# EAGLE design ATC1 (EAGLE 7.4.0)
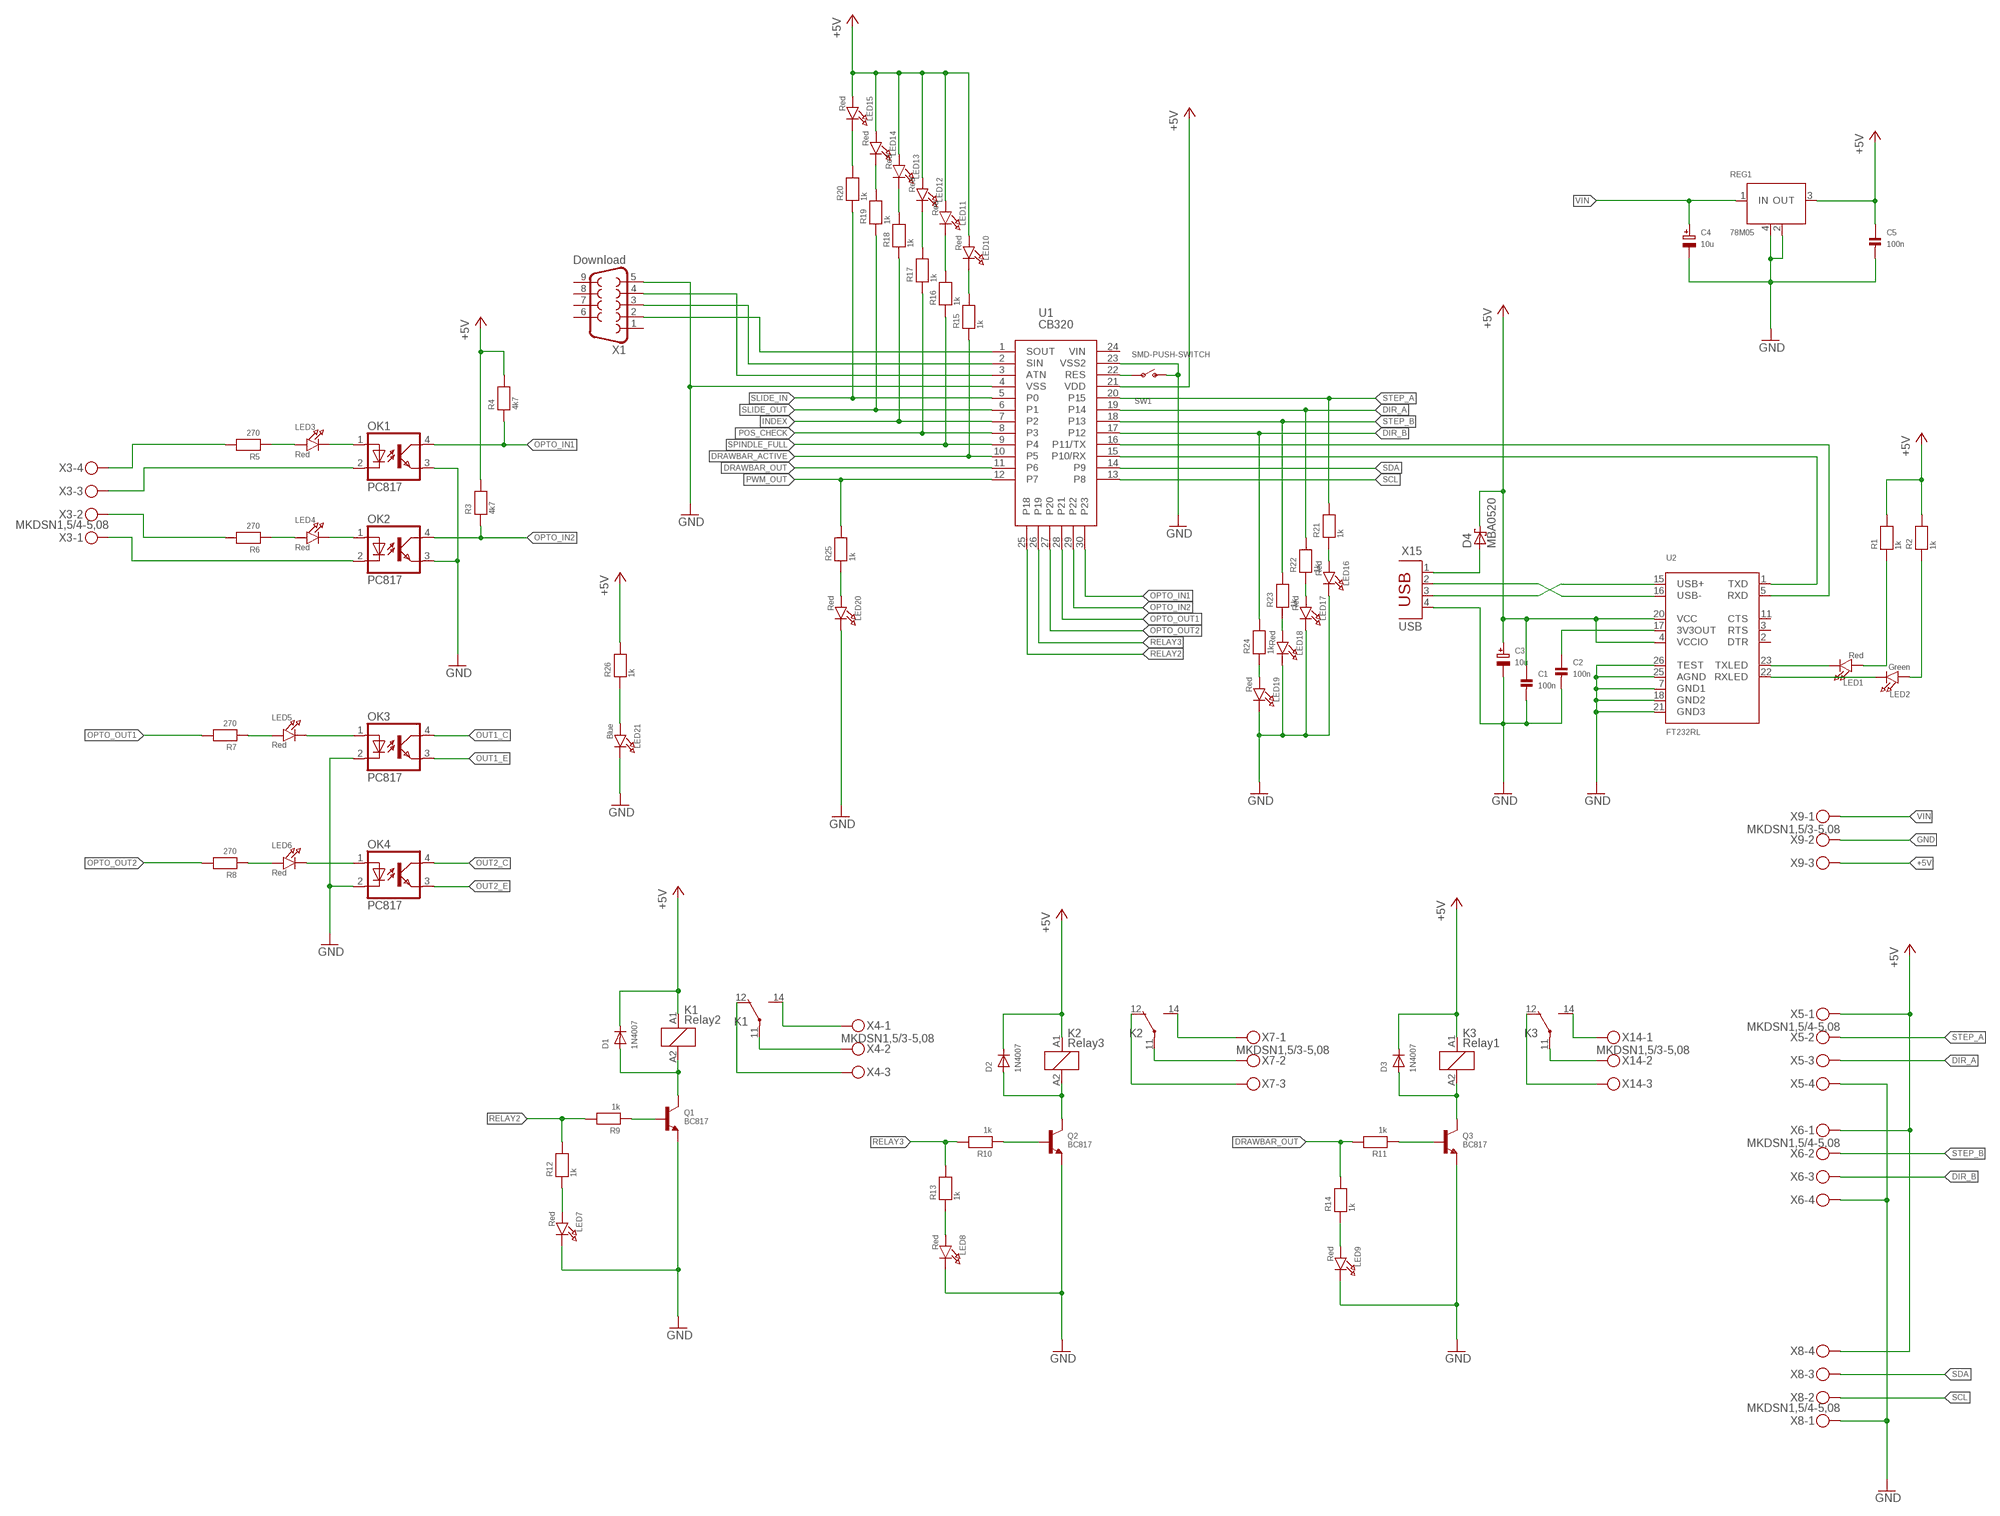
[diagram p0: schematic, sheet 1, part 1 of 2]
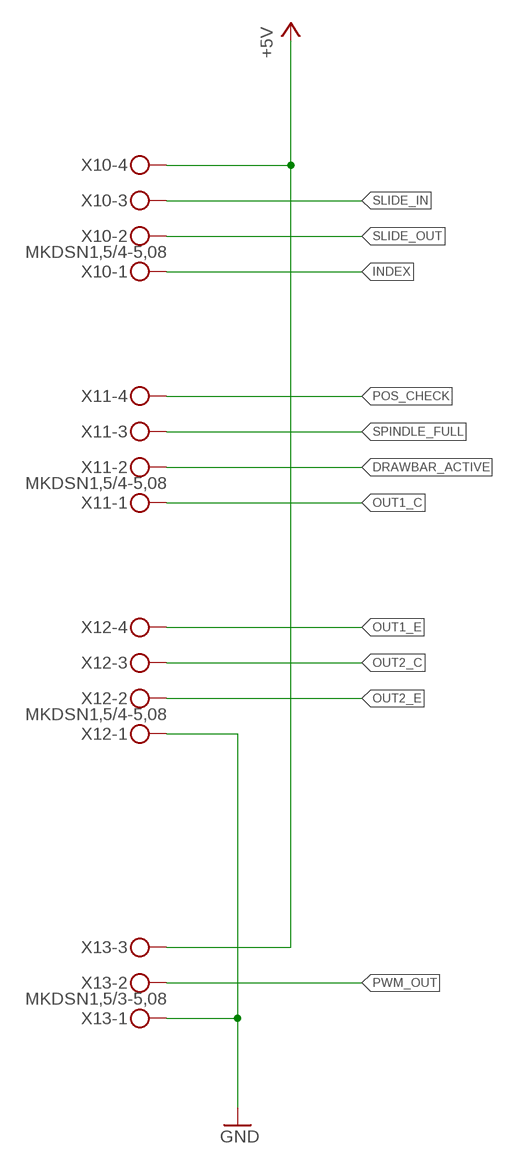
[diagram p1: schematic, sheet 1, part 2 of 2]

## Parts
C1  100n  CAP_CERAMIC0805  [0805]
C2  100n  CAP_CERAMIC0805  [0805]
C3  10u  CAP_TANTALUMA/3216_REFLOW  [EIA3216-18/A-R]
C4  10u  CAP_TANTALUMA/3216_REFLOW  [EIA3216-18/A-R]
C5  100n  CAP_CERAMIC0805  [0805]
D1  1N4007  DIODESOD-123  [SOD-123]
D2  1N4007  DIODESOD-123  [SOD-123]
D3  1N4007  DIODESOD-123  [SOD-123]
D4  MBA0520  MBR0520  [SOD123]
K1  Relay2  SRD-05VDC-SL-C  [SRD]
K2  Relay3  SRD-05VDC-SL-C  [SRD]
K3  Relay1  SRD-05VDC-SL-C  [SRD]
LED1  Red  LED0805  [CHIPLED_0805]
LED2  Green  LED0805  [CHIPLED_0805]
LED3  Red  LED0805  [CHIPLED_0805]
LED4  Red  LED0805  [CHIPLED_0805]
LED5  Red  LED0805  [CHIPLED_0805]
LED6  Red  LED0805  [CHIPLED_0805]
LED7  Red  LED0805  [CHIPLED_0805]
LED8  Red  LED0805  [CHIPLED_0805]
LED9  Red  LED0805  [CHIPLED_0805]
LED10  Red  LED0805  [CHIPLED_0805]
LED11  Red  LED0805  [CHIPLED_0805]
LED12  Red  LED0805  [CHIPLED_0805]
LED13  Red  LED0805  [CHIPLED_0805]
LED14  Red  LED0805  [CHIPLED_0805]
LED15  Red  LED0805  [CHIPLED_0805]
LED16  Red  LED0805  [CHIPLED_0805]
LED17  Red  LED0805  [CHIPLED_0805]
LED18  Red  LED0805  [CHIPLED_0805]
LED19  Red  LED0805  [CHIPLED_0805]
LED20  Red  LED0805  [CHIPLED_0805]
LED21  Blue  LED0805  [CHIPLED_0805]
OK1  PC817  [SM4-GW]
OK2  PC817  [SM4-GW]
OK3  PC817  [SM4-GW]
OK4  PC817  [SM4-GW]
Q1  BC817  TRANSISTOR_NPNWIDE  [SOT23-WIDE]
Q2  BC817  TRANSISTOR_NPNWIDE  [SOT23-WIDE]
Q3  BC817  TRANSISTOR_NPNWIDE  [SOT23-WIDE]
R1  1k  RESISTOR0805  [0805]
R2  1k  RESISTOR0805  [0805]
R3  4k7  RESISTOR0805  [0805]
R4  4k7  RESISTOR0805  [0805]
R5  270  RESISTOR0805  [0805]
R6  270  RESISTOR0805  [0805]
R7  270  RESISTOR0805  [0805]
R8  270  RESISTOR0805  [0805]
R9  1k  RESISTOR0805  [0805]
R10  1k  RESISTOR0805  [0805]
R11  1k  RESISTOR0805  [0805]
R12  1k  RESISTOR0805  [0805]
R13  1k  RESISTOR0805  [0805]
R14  1k  RESISTOR0805  [0805]
R15  1k  RESISTOR0805  [0805]
R16  1k  RESISTOR0805  [0805]
R17  1k  RESISTOR0805  [0805]
R18  1k  RESISTOR0805  [0805]
R19  1k  RESISTOR0805  [0805]
R20  1k  RESISTOR0805  [0805]
R21  1k  RESISTOR0805  [0805]
R22  1k  RESISTOR0805  [0805]
R23  1k  RESISTOR0805  [0805]
R24  1k  RESISTOR0805  [0805]
R25  1k  RESISTOR0805  [0805]
R26  1k  RESISTOR0805  [0805]
REG1  78M05  UA78M05  [UA78M05]
SW1  SMD-PUSH-SWITCH  [PUSH-BUTTON-SMD]
U1  CB320  CUBLOC-CB320  [DIL24]
U2  FT232RL  FT232RLSSOP28  [SSOP28DB]
X1  Download  F09HP  [F09HP]
X3  MKDSN1,5/4-5,08  [MKDSN1,5/4-5,08]
X4  MKDSN1,5/3-5,08  [MKDSN1,5/3-5,08]
X5  MKDSN1,5/4-5,08  [MKDSN1,5/4-5,08]
X6  MKDSN1,5/4-5,08  [MKDSN1,5/4-5,08]
X7  MKDSN1,5/3-5,08  [MKDSN1,5/3-5,08]
X8  MKDSN1,5/4-5,08  [MKDSN1,5/4-5,08]
X9  MKDSN1,5/3-5,08  [MKDSN1,5/3-5,08]
X10  MKDSN1,5/4-5,08  [MKDSN1,5/4-5,08]
X11  MKDSN1,5/4-5,08  [MKDSN1,5/4-5,08]
X12  MKDSN1,5/4-5,08  [MKDSN1,5/4-5,08]
X13  MKDSN1,5/3-5,08  [MKDSN1,5/3-5,08]
X14  MKDSN1,5/3-5,08  [MKDSN1,5/3-5,08]
X15  USB  PN61729  [PN61729]

## Nets
+5V: C1.1 C3.+ C5.1 D1.C D2.C D3.C D4.C K1.A1 K2.A1 K3.A1 LED10.A LED11.A LED12.A LED13.A LED14.A LED15.A R1.2 R2.2 R3.2 R4.2 R26.2 REG1.3(OUT) U1.21(VDD) U2.4(VCCIO) U2.20(VCC) X5.1 X6.1 X8.4 X9.3 X10.4 X13.3
DIR_A: R22.2 U1.19(P14) X5.3
DIR_B: R24.2 U1.17(P12) X6.3
DRAWBAR_ACTIVE: R15.1 U1.10(P5) X11.2
DRAWBAR_OUT: R11.2 R14.2 U1.11(P6)
GND: C1.2 C2.2 C3.- C4.- C5.2 LED7.C LED8.C LED9.C LED16.C LED17.C LED18.C LED19.C LED20.C LED21.C OK1.3(EMIT) OK2.3(EMIT) OK3.2(C) OK4.2(C) Q1.2(E) Q2.2(E) Q3.2(E) REG1.2(COMMON1) REG1.4(COMMON2) SW1.P$2(S) U1.4(VSS) U1.23(VSS2) U2.7(GND1) U2.18(GND2) U2.21(GND3) U2.25(AGND) U2.26(TEST) X1.5 X5.4 X6.4 X8.1 X9.2 X12.1 X13.1 X15.4
INDEX: R18.1 U1.7(P2) X10.1
N$1: U2.15(USB+) X15.3
N$2: U2.16(USB-) X15.2
N$3: U1.2(SIN) X1.3
N$4: C2.1 U2.17(3V3OUT)
N$5: LED3.C OK1.1(A)
N$6: U1.1(SOUT) X1.2
N$7: LED2.C U2.22(RXLED)
N$8: LED1.C U2.23(TXLED)
N$9: LED1.A R1.1
N$10: LED2.A R2.1
N$11: LED3.A R5.1
N$12: U1.15(P10/RX) U2.1(TXD)
N$13: U1.16(P11/TX) U2.5(RXD)
N$14: U1.3(ATN) X1.4
N$15: R5.2 X3.4
N$16: LED4.C OK2.1(A)
N$17: LED4.A R6.1
N$18: R6.2 X3.2
N$19: OK1.2(C) X3.3
N$20: OK2.2(C) X3.1
N$21: LED5.A R7.1
N$22: LED5.C OK3.1(A)
N$23: LED6.A R8.1
N$24: LED6.C OK4.1(A)
N$25: Q1.1(B) R9.1
N$26: Q2.1(B) R10.1
N$27: D2.A K2.A2 Q2.3(C)
N$28: D1.A K1.A2 Q1.3(C)
N$29: Q3.1(B) R11.1
N$30: D3.A K3.A2 Q3.3(C)
N$31: K3.14(O) X14.1
N$32: K3.11(P) X14.2
N$33: K1.14(O) X4.1
N$34: K1.11(P) X4.2
N$35: K1.12(C) X4.3
N$36: K2.11(P) X7.2
N$37: K2.12(C) X7.3
N$38: K2.14(O) X7.1
N$39: K3.12(C) X14.3
N$40: D4.A X15.1
N$42: SW1.P$1(P) U1.22(RES)
N$46: LED9.A R14.1
N$47: LED8.A R13.1
N$48: LED7.A R12.1
N$49: LED10.C R15.2
N$50: LED11.C R16.2
N$51: LED12.C R17.2
N$52: LED13.C R18.2
N$53: LED14.C R19.2
N$54: LED15.C R20.2
N$56: LED19.A R24.1
N$57: LED20.A R25.1
N$58: LED17.A R22.1
N$59: LED18.A R23.1
N$60: LED16.A R21.1
N$62: LED21.A R26.1
OPTO_IN1: OK1.4(COL) R4.1 U1.30(P23)
OPTO_IN2: OK2.4(COL) R3.1 U1.29(P22)
OPTO_OUT1: R7.2 U1.28(P21)
OPTO_OUT2: R8.2 U1.27(P20)
OUT1_C: OK3.4(COL) X11.1
OUT1_E: OK3.3(EMIT) X12.4
OUT2_C: OK4.4(COL) X12.3
OUT2_E: OK4.3(EMIT) X12.2
POS_CHECK: R17.1 U1.8(P3) X11.4
PWM_OUT: R25.2 U1.12(P7) X13.2
RELAY2: R9.2 R12.2 U1.25(P18)
RELAY3: R10.2 R13.2 U1.26(P19)
SCL: U1.13(P8) X8.2
SDA: U1.14(P9) X8.3
SLIDE_IN: R20.1 U1.5(P0) X10.3
SLIDE_OUT: R19.1 U1.6(P1) X10.2
SPINDLE_FULL: R16.1 U1.9(P4) X11.3
STEP_A: R21.2 U1.20(P15) X5.2
STEP_B: R23.2 U1.18(P13) X6.2
VIN: C4.+ REG1.1(IN) X9.1
Unconnected: U1.24(VIN) U2.2(DTR) U2.3(RTS) U2.11(CTS) X1.1 X1.6 X1.7 X1.8 X1.9

## Library data of the parts
C1 C2 C5 = microbuilder:CAP_CERAMIC: Ceramic Capacitors 0402 - 0402 Surface Mount Capacitors 16pF 50V 5% [Digikey: 445-4899-2-ND] 18pF 50V 5% [Digikey: 490-1281-2-ND] 22pF 50V 5% [Digikey: 490-1283-2-ND] 68pF 50V 5% [Digikey: 490-1289-2-ND] 0.1uF 10V 10% [Digikey: 490-1318-2-ND] 1.0uF 6.3V 10% [Digikey: 490-1320-2-ND] 0603 - 0603 Surface Mount Capacitors 16 pF 50V 5% [Digikey: 445-5051-2-ND] 22 pF 50V [Digikey: PCC220ACVTR-ND] 33 pF 50V 5% [Digikey: 490-1415-1-ND] 56pF 50V 5% [Digikey: 490-1421-1-ND] 220pF 50V 5% [Digikey: 445-1285-1-ND] 680 pF 50V 2200 pF 50V 5% C0G [Digikey: 445-1297-1-ND] 5600 pF 100V 5% X7R [Digikey: 478-3711-1-ND] 0.1 µF 25V 10% [Digikey: PCC2277TR-ND] 0.22 µF 16V 10% X7R [Digikey: 445-1318-1-ND] 1.0 µF 25V 10% [Digikey: 445-5146-2-ND] 0603 - RF Specific 3pF 250V +/-0.1pF RF [Digikey: 712-1347-1-ND] 18 pF 250V 5% [Digikey: 478-3505-1-ND or 712-1322-1-ND] 56 pF 250V 5% C0G RF [Digikey: 490-4867-1-ND] 68 pF 250V RF [Digikey: 490-4868-1-ND] 0805 - 0805 Surface Mount Capacitors 220 pF 250V 2% RF Ceramic Capacitor [Digikey: 712-1398-1-ND] 1000 pF 50V 2% NP0 Ceramic Capacitor [Digikey: 478-3760-1-ND] 0.1 µF 25V 10% Ceramic Capacitor [Digikey: PCC1828TR-ND] 1.0 µF 16V 10% Ceramic Capacitor[Digikey: 490-1691-2-ND] 10.0 µF 10V 10% Ceramic Capacitor[Digikey: 709-1228-1-ND] 10.0 uF 16V 10% Ceramic Capacitor [Digikey: 478-5165-2-ND] 47 uF 6.3V 20% Ceramic Capacitor [Digikey: 587-1779-1-ND or 399-5506-1-ND] 1206 - 1206 Surface Mount Capacitors 47uF 10V 20% Ceramic Capacitor [Digikey: 490-5528-1-ND or 399-5508-1-ND or 445-6010-1-ND] 100uF 6.3V -20%, +80% Y5V Ceramic Capacitor (Digikey: 490-4512-1-ND, Mouser: 81-GRM31CF50J107ZE1L)
C3 C4 = microbuilder:CAP_TANTALUM: Tantalum Capacitors Wave footprints have larger pads and are meant to be used for hand soldering. Reflow footprints are optimised for solder paste and a reflow oven. EIA3216-18/A-[R/W] - Size A / 3216-18 / 1206 footprint 4.7µF 25V 10% Tantalum Capacitor 10µF 16V 10% Tantalum Capacitor [Digikey: 495-2236-2-ND] EIA3528-21/B-[R/W] - Size B / 3528-21 47µF 10V 10% Tantalum Capactior [Digikey: 495-2216-1-ND] EIA6032-28/C-[R/W] - Size C / 6032-28 10µF 35V 20% Tantalum Capacitor [Digikey: 495-2285-1-ND] 100µF 16V 10% Tantalum Capactior [Digikey: 399-5214-1-ND]
D1-D3 = adafruit:DIODE: Diode SMADIODE - SMA Surface Mount Package 20V 1A Schottky Diode Digikey: 641-1014-6-ND DO-1N4148 - Through Hole Small Current Diode SOD-123 20V 1 A (.5mV Vf) Schottky Diode - Digikey: MBRX120TPMSCT-ND SOD-323 10V 570mA (.38mV Vf, 3ns) Schottky Diode - Digikey: ZLLS410CT-ND SOD-523 30V 30mA Schottky Diode (RB751S-40TE61) - Digikey: RB751S-40TE61CT-ND SOT23-R/W - SOT23 Package (R = Solder Paste/Reflow Ovens, W = Hand-Soldering) BAT54Film 40V 300mA - Digikey: 497-7162-1-ND
D4 = Peters:MBR0520
K1-K3 = Peters:SRD-05VDC-SL-C
LED1-LED21 = microbuilder:LED: LED 0603 - 0603 Surface Mount Package 2mA: Green LED - Low Power (3.9mcd, 2ma, 1.7Vf) - Digikey: 475-2709-2-ND Orange LED - Low Power (9.8mcd, 2ma, 1.8Vf) - Digikey: 475-1194-2-ND Red LED - Low Power (5mcd, 2ma, 1.8Vf) - Digikey: 475-1195-2-ND Yellow LED - Low Power (7mcd, 2ma, 1.8Vf) - Digikey: 475-1196-2-ND 5mA: Blue LED - Low Power (17mcd, 5ma, 2.9Vf) - Digikey: LNJ937W8CRACT-ND 0805 - 0805 Surface Mount Package 2mA: Red LED (8.8mcd, 2mA, 1.8Vf, Clear) - Low Power [Digikey: 475-2510-1-ND] Green LED (5mcd, 2mA, 1.8Vf, Clear) - Low Power [Digikey: 475-2730-1-ND] Yellow LED (11.3mcd, 2mA, 1.8Vf, Clear) - Low Power [Digikey: 475-2555-1-ND] 20mA: Red LED (104mcd, 20mA, Diffused) - LS R976 [Digikey: 475-1278-6-ND] Red LED (12mcd, 20mA, 2.0Vf, Clear) - APT2012EC [Digikey: 754-1128-1-ND] Green LED (15mcd, 20mA, 2.2Vf, Clear) - APT2012GC [Digikey: 754-1131-1-ND] Orange LED (160mcd, 20mA, 2.1Vf, Clear) - APT2012SECK [Digikey: 754-1130-1-ND] 1206 - 1206 Surface Mount Package Green LED (26mcd, 20mA, Diffused) - LG N971 [Digikey: 475-1407-6-ND] Red LED (15mcd, 20mA, Diffused) - LH N974 [Digikey: 475-1416-6-ND]
OK1-OK4 = Peters:PC817
Q1-Q3 = microbuilder:TRANSISTOR_NPN: NPN Transistor Transistor (NPN) 500mA 45V - BC817 [Digikey: 568-1631-1-ND] Transistor (NPN) 500mA 45V - BC817,215 [Mouser: 771-BC817-T/R] SOT23-R - SOT23 footprint optimised for use with solder paste and reflow ovens. SOT23-W - SOT23 footprint optimised for hand-soldering (larger pads).
R1-R26 = microbuilder:RESISTOR: Resistors 0402 - 0402 Surface Mount Package 22 Ohm 1% 1/16W [Digikey: 311-22.0LRTR-ND] 33 Ohm 5% 1/16W 1.0K 5% 1/16W 1.5K 5% 1/16W 2.0K 1% 1/16W 10.0K 1% 1/16W [Digikey: 311-10.0KLRTR-ND] 10.0K 5% 1/16W [Digikey: RMCF0402JT10K0TR-ND] 12.1K 1% 1/16W [Digikey: 311-22.0LRTR-ND] 100.0K 5% 1/16W 0603 - 0603 Surface Mount Package 0 Ohm 1/10 Watt 1% Resistor 15 Ohm 1/10 Watt 1% Resistor 33 Ohm 1/10 Watt 1% Resistor 49.9 Ohm 1/10 Watt 1% Resistor 100 Ohm 1/10 Watt 1% Resistor 150 Ohm 1/10 Watt 1% Resistor 240 Ohm 1/10 Watt 1% Resistor 390 Ohm 1/10 Watt 1% Resistor 560 Ohm 1/10 Watt 1% Resistor 680 Ohm 1/10 Watt 1% Resistor 750 Ohm 1/10 Watt 1% Resistor 1.0K Ohm 1/10 Watt 1% Resistor 1.5K Ohm 1/10 Watt 1% Resistor 2.0K Ohm 1/10 Watt 1% Resistor 2.2K Ohm 1/10 Watt 1% Resistor 3.3K Ohm 1/10 Watt 1% Resistor 4.7K Ohm 1/10 Watt 1% Resistor 10.0K Ohm 1/10 Watt 1% Resistor 12.0K Ohm 1/10 Watt 1% Resistor 12.1K Ohm 1/10 Watt 1% Resistor 20.0K Ohm 1/10 Watt 1% Resistor 33.0K Ohm 1/10 Watt 1% Resistor 100.0K Ohm 1/10 Watt 1% Resistor 0805 - 0805 Surface Mount Package 0 Ohm 1/8 Watt 1% Resistor 33 Ohm 1/8 Watt 1% Resistor 100 Ohm 1/8 Watt 1% Resistor 150 Ohm 1/8 Watt 1% Resistor 200 Ohm 1/8 Watt 1% Resistor 240 Ohm 1/8 Watt 1% Resistor 330 Ohm 1/8 Watt 1% Resistor 390 Ohm 1/8 Watt 1% Resistor 470 Ohm 1/8 Watt 1% Resistor 1.0K Ohm 1/8 Watt 1% Resistor 1.5K Ohm 1/8 Watt 1% Resistor 2.0K Ohm 1/8 Watt 1% Resistor 4.7K Ohm 1/8 Watt 1% Resistor 5.1K Ohm 1/8 Watt 1% Resistor 5.6K Ohm 1/8 Watt 1% Resistor 10.0K Ohm 1/8 Watt 1% Resistor 22.0K Ohm 1/8 Watt 1% Resistor 33.0K Ohm 1/8 Watt 1% Resistor 100K Ohm 1/8 Watt 1% Resistor 1206 - 1206 Surface Mount Package 2012 - 2010 Surface Mount Package 0.11 Ohm 1/2 Watt 1% Resistor - Digikey: RHM.11UCT-ND
REG1 = Peters:UA78M05
SW1 = Peters:SMD-PUSH-SWITCH
U1 = Peters:CUBLOC-CB320: Cubloc CB-320 PLC
U2 = microbuilder:FT232RL: FTDI FT232RL USB TO RS232 Converter Digikey: 768-1007-1-ND
X1 = con-subd:F09: SUB-D; OC_FARNELL: unknown; OC_NEWARK: unknown
X3 X5 X6 X8 X10-X12 = con-phoenix-508:MKDSN1,5/4-5,08: MKDSN 1,5/ 4-5,08 Printklemme Nennstrom: 13,5 A Nennspannung: 250 V Rastermaß: 5,08 mm Polzahl: 4 Anschlussart: Schraubanschluss Montage: Löten Anschlussrichtung Leiter/Platine: 0 ° Artikelnummer: 1729144 Source: http://eshop.phoenixcontact.com .. 1729144.pdf
X4 X7 X9 X13 X14 = con-phoenix-508:MKDSN1,5/3-5,08: MKDSN 1,5/ 3-5,08 Printklemme Nennstrom: 13,5 A Nennspannung: 250 V Rastermaß: 5,08 mm Polzahl: 3 Anschlussart: Schraubanschluss Montage: Löten Anschlussrichtung Leiter/Platine: 0 ° Artikelnummer: 1729131 Source: http://eshop.phoenixcontact.com .. 1729131.pdf
X15 = con-berg:PN61729: BERG USB connector; OC_FARNELL: unknown; OC_NEWARK: unknown

## Board
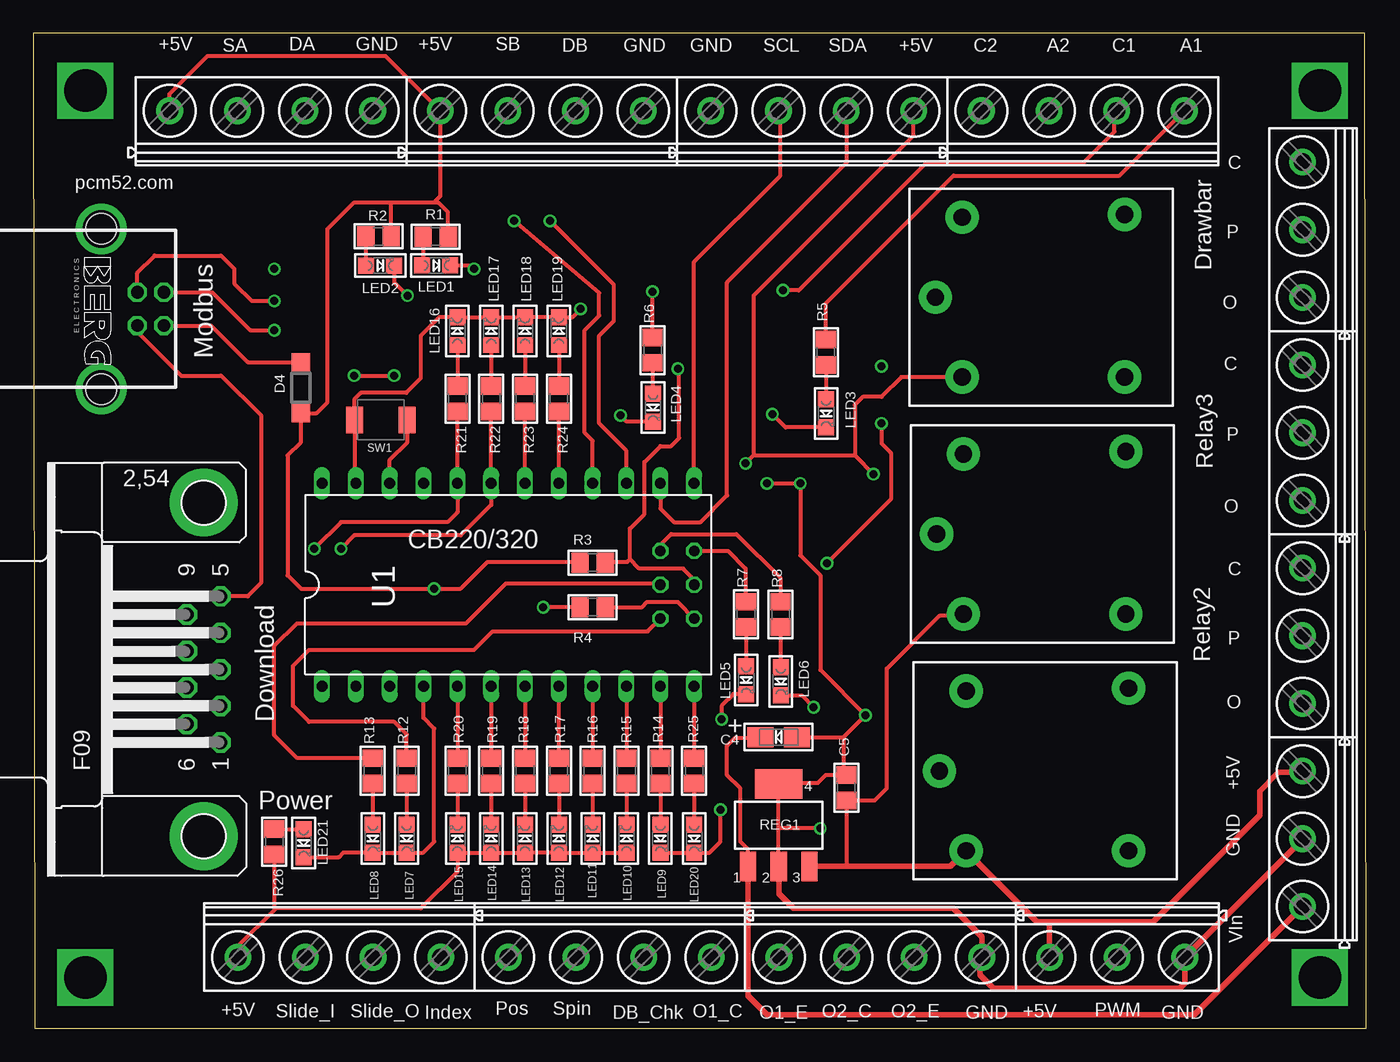
[diagram p2: board, top side]
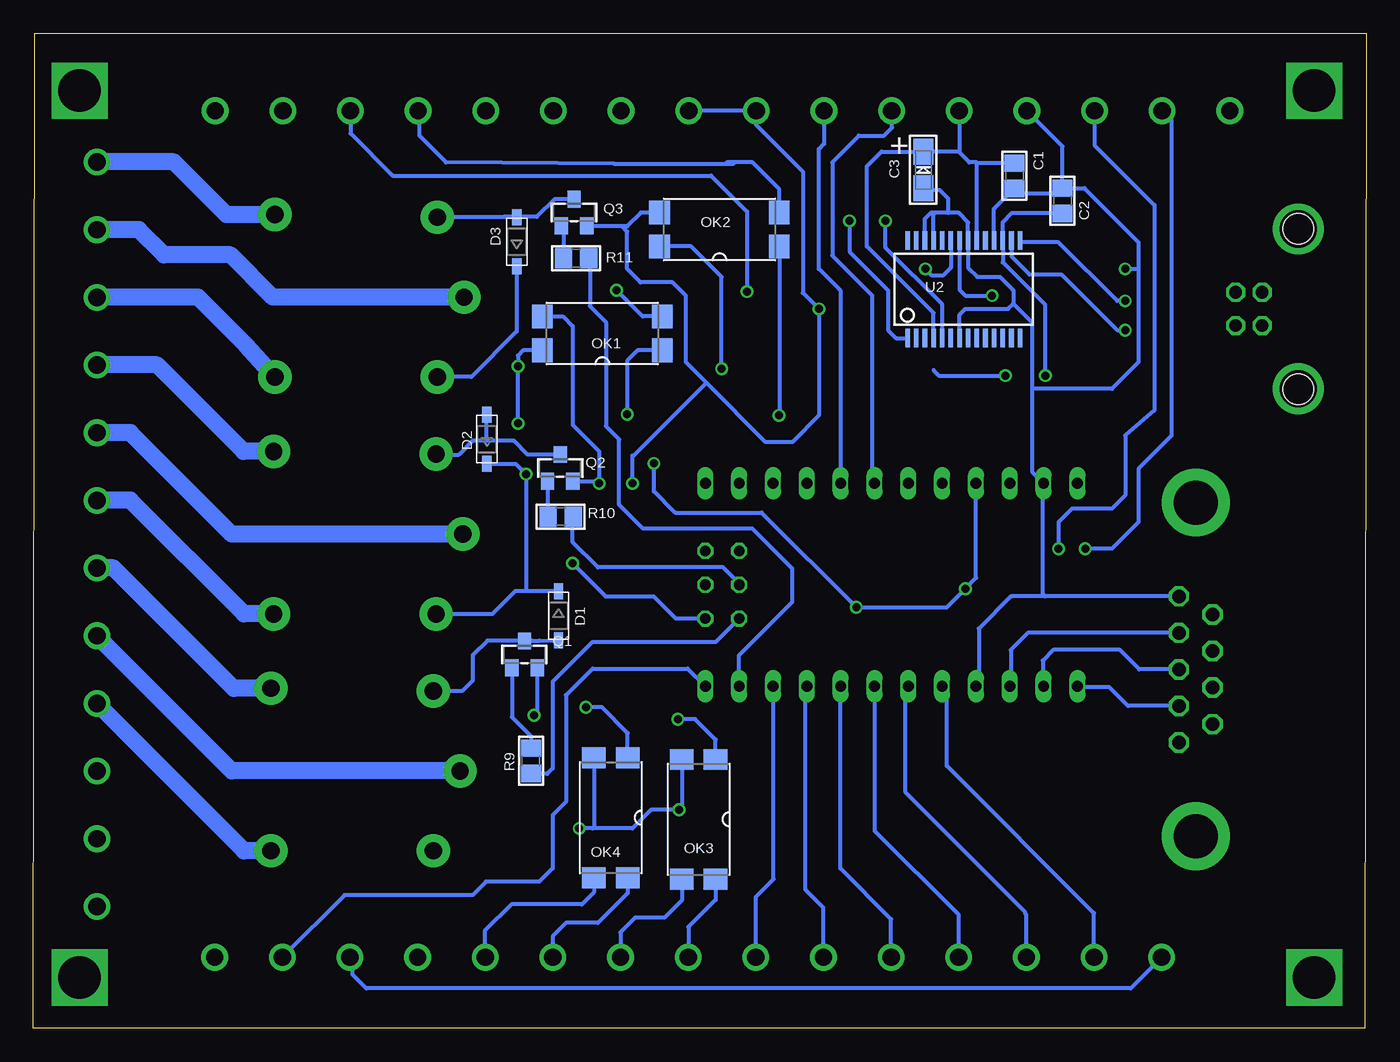
[diagram p3: board, bottom side, seen from below]

Size 100.1 x 74.69 mm. Coordinates in mm from the lower left corner, seen from the top.
Outline: 0.1,0 100.1,0 100,74.69 0,74.69 0.1,0
Copper layers (1*16): Top 0.0356mm / dielectric 1.5011mm / Bottom 0.0356mm
Design rules "LaenPCBOrder": minimum track width 6mil, minimum drill 13mil, track to track 6mil, track to pad 6mil, pad to pad 6mil, via to via 6mil, smd to smd 6mil, copper to edge 15mil, drill to drill 6mil, minimum pad ring 7mil, minimum via ring 7mil, stop-mask expansion 3mil, vias tented up to drill 0mil, thermal gap 10mil

### Footprints (pad centres in the part's own frame; a part is rotated, then mirrored left to right if it is on the bottom)
0805 = smd 1.3 x 1.5: 1 -0.95,0; 2 0.95,0
EIA3216-18/A-R = smd 1.95 x 1.5: + 1.375,0; - -1.375,0
SOD-123 = smd 1.2 x 0.7: A 1.85,0; C -1.85,0
SOD123 = smd 1.4 x 1.4: A 1.265,0; C -2.535,0
SRD = drill 1.3 pad 2.5: 11 7.62,0; 12 -6.58,-6.2; 14 -6.58,6; A1 5.62,6; A2 5.62,-6
CHIPLED_0805 = smd 1.2 x 1.2: A 0,-1.05; C 0,1.05
SM4-GW = smd 1.55 x 1.78: 1 9.31,0; 2 9.31,2.54; 3 0.31,2.54; 4 0.31,0
SOT23-WIDE = smd 1 x 1.27: 1 -0.95,-1; 2 0.95,-1; 3 0,1
UA78M05 = smd 1.219 x 2.235: 1 -2.311,-3.099; 2 0,-3.099; 3 2.311,-3.099 | smd 3.6 x 2.2: 4 0,3.099
PUSH-BUTTON-SMD = smd 1.27 x 2: P$1 -2.22,0; P$2 1.72,0
DIL24 = drill 0.813 long: 1 -7.62,12.7; 2 -7.62,10.16; 3 -7.62,7.62; 4 -7.62,5.08; 5 -7.62,2.54; 6 -7.62,0; 7 -7.62,-2.54; 8 -7.62,-5.08; 9 -7.62,-7.62; 10 -7.62,-10.16; 11 -7.62,-12.7; 12 -7.62,-15.24; 13 7.62,-15.24; 14 7.62,-12.7; 15 7.62,-10.16; 16 7.62,-7.62; 17 7.62,-5.08; 18 7.62,-2.54; 19 7.62,0; 20 7.62,2.54; 21 7.62,5.08; 22 7.62,7.62; 23 7.62,10.16; 24 7.62,12.7 | drill 0.8 octagon: 25 -2.54,-12.7; 26 0,-12.7; 27 2.54,-12.7; 28 2.54,-15.24; 29 0,-15.24; 30 -2.54,-15.24
SSOP28DB = smd 0.348 x 1.397: 1 -4.225,-3.656; 2 -3.575,-3.656; 3 -2.925,-3.656; 4 -2.275,-3.656; 5 -1.625,-3.656; 6 -0.975,-3.656; 7 -0.325,-3.656; 8 0.325,-3.656; 9 0.975,-3.656; 10 1.625,-3.656; 11 2.275,-3.656; 12 2.925,-3.656; 13 3.575,-3.656; 14 4.225,-3.656; 15 4.225,3.656; 16 3.575,3.656; 17 2.925,3.656; 18 2.275,3.656; 19 1.625,3.656; 20 0.975,3.656; 21 0.325,3.656; 22 -0.325,3.656; 23 -0.975,3.656; 24 -1.625,3.656; 25 -2.275,3.656; 26 -2.925,3.656; 27 -3.575,3.656; 28 -4.225,3.656
F09HP = drill 1.016 octagon: 1 -5.486,-1.27; 2 -2.743,-1.27; 3 0,-1.27; 4 2.743,-1.27; 5 5.486,-1.27; 6 -4.115,1.27; 7 -1.372,1.27; 8 1.372,1.27; 9 4.115,1.27 | drill 3.302 pad 5.08: G1 -12.522,0; G2 12.522,0
MKDSN1,5/4-5,08 = drill 1.3 pad 2: 1 -7.641,0.025; 2 -2.561,0.025; 3 2.519,0.025; 4 7.599,0.025
MKDSN1,5/3-5,08 = drill 1.3 pad 2: 1 -7.641,0.025; 2 -2.561,0.025; 3 2.519,0.025
PN61729 = drill 0.95 octagon: 1 1.25,4.71; 2 -1.25,4.71; 3 -1.25,2.71; 4 1.25,2.71 | hole 2.3: -6.02,0; 6.02,0

### Placement (x,y rotation side)
C1  26.41,63.99 270 bottom
C2  22.81,62.11 90 bottom
C3  33.26,64.43 90 bottom
C4  55.98,21.86 180 top
C5  61.06,18.05 90 top
D1  60.66,30.96 270 bottom
D2  66.04,44.22 90 bottom
D3  63.79,59.04 90 bottom
D4  20.1,48.72 90 top
K1  75.67,19.32 180 top
K2  75.47,37.1 180 top
K3  75.37,54.88 180 top
LED1  30.26,57.26 270 top
LED2  26.06,57.25 270 top
LED3  59.54,46.15 180 top
LED4  46.54,46.59 180 top
LED5  53.54,26.13 180 top
LED6  56.14,26.04 180 top
LED7  28.04,14.24 180 top
LED8  25.5,14.24 180 top
LED9  47.09,14.24 180 top
LED10  44.55,14.24 0 top
LED11  42.01,14.24 0 top
LED12  39.47,14.24 0 top
LED13  36.93,14.24 0 top
LED14  34.39,14.24 0 top
LED15  31.85,14.24 0 top
LED16  31.85,52.34 0 top
LED17  34.39,52.34 0 top
LED18  36.93,52.34 0 top
LED19  39.47,52.34 0 top
LED20  49.63,14.24 180 top
LED21  20.3,13.9 180 top
OK1  62.18,50.89 0 bottom
OK2  53.38,58.69 0 bottom
OK3  48.86,10.87 90 bottom
OK4  55.46,10.99 90 bottom
Q1  63.21,28.07 0 bottom
Q2  60.53,42.07 0 bottom
Q3  59.49,61.23 0 bottom
R1  30.22,59.43 0 top
R2  25.92,59.44 0 top
R3  42.01,34.96 180 top
R4  42.01,31.62 180 top
R5  59.52,50.75 90 top
R6  46.52,50.91 90 top
R7  53.52,31.07 90 top
R8  56.12,31.06 90 top
R9  62.73,20.07 270 bottom
R10  60.49,38.4 0 bottom
R11  59.33,57.8 0 bottom
R12  28.04,19.32 90 top
R13  25.5,19.32 90 top
R14  47.09,19.32 90 top
R15  44.55,19.32 270 top
R16  42.01,19.32 270 top
R17  39.47,19.32 270 top
R18  36.93,19.32 270 top
R19  34.39,19.32 270 top
R20  31.85,19.32 270 top
R21  31.85,47.26 270 top
R22  34.39,47.26 270 top
R23  36.93,47.26 270 top
R24  39.47,47.26 270 top
R25  49.63,19.32 90 top
R26  18.1,14 270 top
REG1  55.98,15.24 0 top
SW1  25.84,45.67 180 top
U1  34.39,33.29 90 top
U2  30.22,55.48 0 bottom
X1  12.8,26.94 90 top
X3  78.84,68.85 0 top
X4  95.35,32.02 90 top
X5  17.88,68.85 0 top
X6  38.2,68.85 0 top
X7  95.35,47.26 90 top
X8  58.52,68.85 0 top
X9  95.35,16.78 90 top
X10  22.96,5.35 180 top
X11  43.28,5.35 180 top
X12  63.6,5.35 180 top
X13  78.84,5.35 180 top
X14  95.35,62.5 90 top
X15  5.1,54 270 top

### Tracks (layer width: path | path; a pad name or v marks a point on that pad's centre or on a via)
+5V  (via drill 0.6)
  Top 0.305: LED10.A LED11.A LED12.A LED13.A LED14.A LED15.A 31.85,11.75 29.1,9 18.2,9 18.15,8.95 | X9.3 95.32,19.23 | 54.1,43 54.1,55 66.1,67 66.1,68.86 X8.4 | X10.4 15.36,6.16 18.15,8.95 | R4.2 38.32,31.62 v38.3,31.6 | 54.1,43 v53.5,42.4 | X5.1 10.24,70.14 13.1,73 26.43,73 X6.1 30.56,62.46 30.1,62 | R3.2 41.02,35 34.1,35 32.1,33 v30.1,33 20.1,33 19.1,34 19.1,43 20.1,44 D4.C 21.29,46.19 22.1,47 22.1,60 24.1,62 26.9,62 | 54.1,43 61.7,43 | 61.7,43 v63.1,41.6 | K2.A1 69.75,31 68.1,31 64.1,27 64.1,18 63.2,17.1 C5.1 61.06,12.18 61.1,12.14 | K3.A1 65.18,48.88 63.7,47.4 62.3,47.4 61.7,46.8 61.7,43 | 26.9,62 30.1,62 | 30.1,62 30.4,62 31.1,61.3 31.1,59.5 R1.2 | R2.2 26.87,61.97 26.9,62 | R26.2 18.1,9 18.15,8.95
  Top 0.406: 76.1,8 84.1,8 92.1,16 92.1,17.8 93.5,19.2 95.23,19.2 X9.3 | 76.1,8 75.37,8 K1.A1 68.87,12.14 61.1,12.14 REG1.3 | X13.3 76.32,7.78 76.1,8
  Bottom 0.305: X13.3 76.1,5.1 76.1,4 75.1,3 17.69,3 X10.4 | U1.21 29.3,33.8 v30.1,33 31.5,31.6 v38.3,31.6 45.4,38.7 51.9,38.7 53.5,40.3 v53.5,42.4 | 30.6,65.8 C3.+ 36.4,65.8 37.5,64.7 37.5,58.7 32.5,53.7 U2.4 | X6.1 30.56,65.84 30.6,65.8 | 29.25,65 29.8,65 30.6,65.8 | U2.20 29.25,65 | C1.1 29.19,64.94 29.25,65 | D3.C 63.79,52.31 67.2,48.9 69.73,48.9 K3.A1 | D1.C 63.1,32.81 | 63.1,32.81 63.91,32.81 65.62,31.1 K2.A1 | D2.C 63.87,42.37 v63.1,41.6 63.1,32.81
DIR_A  (via drill 0.6)
  Top 0.305: R22.2 U1.19 34.39,39.29 32.1,37 24.1,37 v23.1,36
  Bottom 0.305: X5.3 20.4,66.3 15.9,61.8 15.9,46.4 18.1,44.5 18.1,40 19.1,39 22.1,39 23.1,38 v23.1,36
DIR_B
  Top 0.305: U1.17 R24.2
  Bottom 0.305: U1.17 39.5,40.94 39.5,55.4 41.1,57 41.1,66 40.72,66.38 X6.3
DRAWBAR_ACTIVE
  Top 0.305: U1.10 R15.1
  Bottom 0.305: X11.2 45.84,9.86 44.5,11.2 44.5,25.62 U1.10
DRAWBAR_OUT
  Top 0.305: U1.11 R14.2
  Bottom 0.305: U1.11 47.09,28.01 43.1,32 43.1,34.5 46.1,37.5 54.3,37.5 56.1,39.3 56.1,44.2 57.1,45.2 57.1,53 58.3,54.2 58.3,57.72 R11.2 58.4,57.78
GND  (via drill 0.6)
  Top 0.305: LED9.C LED20.C 50.79,13.19 51.6,14 v51.6,16.4 | REG1.2 55.98,15 | 55.98,15 REG1.4 | 56,17.36 REG1.4 | 60.96,18.9 C5.2 | X9.2 95.32,14.17 | 60.86,21.86 v62.5,23.5 59.1,26.9 59.1,34 57.6,35.5 v57.6,40.9 v55.1,40.9 | U1.4 29.3,23.3 30.1,22.5 30.1,14 29.29,13.19 LED7.C LED8.C 23.3,13.2 22.95,12.85 LED21.C | 24.1,41.04 U1.23 24.12,41.02 SW1.P$2 24.1,45.69 24.1,47.2 24.6,47.7 28,47.7 29.1,48.8 29.1,52 30.49,53.39 LED16.C LED17.C LED18.C LED19.C 40.49,53.39 v41.1,54 | v59.1,15 55.98,15 | 17.99,57.11 v18.1,57 | X15.4 7.81,52.29 11.1,49 14.1,49 17.1,46 17.1,33.43 16.1,32.43 X1.5 | C5.2 59.5,19 58.9,18.4 56.04,18.4 REG1.4 | 60.86,21.86 60.86,19.2 C5.2 | C4.- 60.86,21.86
  Top 0.406: 95.32,14.17 X13.1 86.48,3.38 86.1,3 72.1,3 71.1,4 71.1,5.18 X12.1 71.24,6.86 69.1,9 57.1,9 56,10.1 56,12.12 REG1.2
  Bottom 0.305: X1.5 24.1,32.43 | 24.1,32.43 26.67,32.43 29.1,30 29.1,25.88 U1.4 | U2.18 27.95,61.51 C1.2 | C1.2 26.4,62.7 23.17,62.7 C2.2 | 26.39,63.06 C1.2 | C2.2 21.16,63.06 17.1,59 17.1,57 | 58.47,60.3 Q3.2 58.51,60.2 55.9,60.2 | 51.44,16.56 v51.6,16.4 | v51.6,16.4 53.7,16.4 55.1,15 58.1,15 | 58.1,15 v59.1,15 | v55.1,40.9 55.1,43 55,43 49.55,48.45 | 59.6,41.09 Q2.2 57.77,41.07 v57.6,40.9 57.6,43.3 59.6,45.3 59.6,52.7 60.33,53.43 OK1.3 | 50.9,68.85 X8.1 X6.4 45.8,67.8 42.3,64.3 42.3,55.2 v41.1,54 41.1,46 43.1,44 45.1,44 49.55,48.45 | 26.5,54.4 26.5,55.4 27.5,56.4 29.2,56.4 29.9,57.09 U2.21 29.9,60.49 30.6,61.2 31.4,61.2 | U2.7 30.55,53.55 30.1,54 26.9,54 26.5,54.4 | 26.5,54.4 25.1,53 25.1,48 | 25.1,48 25.1,41.78 U1.23 24.3,40.84 24.3,32.63 24.1,32.43 | C2.2 22.81,66.21 X5.4 | 17.1,57 17.1,50 19.1,48 25.1,48 | v18.1,57 17.1,57 | 33.2,63 C3.- 33.15,62.94 32.04,62.94 31.4,62.3 31.4,61.2 | Q1.2 62.26,23.74 v62.5,23.5 | OK2.3 54.47,61.23 55.5,60.2 55.9,60.2 | 49.55,48.45 51.1,50 51.1,55 52.1,56 54.5,56 55.5,57 55.5,59.8 55.9,60.2 | OK3.2 51.4,16.6 v51.6,16.4 | OK4.2 58,15.1 58.1,15 | 31.4,61.2 32.6,61.2 | 32.6,61.2 32.7,61.2 33.15,60.76 U2.26 | U2.25 32.5,61.09 32.6,61.2
INDEX
  Top 0.305: U1.7 R18.1
  Bottom 0.305: X10.1 30.6,8.5 36.9,14.8 36.9,25.64 U1.7
N$1  (via drill 0.6)
  Top 0.305: v18.09,54.61 v18.1,54.6 16.4,54.6 15.1,55.9 15.1,57 14.1,58 9.1,58 7.81,56.71 X15.3
  Bottom 0.305: v18.1,54.6 18.7,54.6 23.1,59 25.86,59 U2.15
N$2  (via drill 0.6)
  Top 0.305: 17.89,52.61 v18.1,52.4 16.3,52.4 13.45,55.25 X15.2
  Bottom 0.305: U2.16 26.65,57.95 25.3,56.6 22.9,56.6 18.7,52.4 v18.1,52.4
N$3
  Bottom 0.305: X1.3 17.04,26.94 18.5,28.4 23.5,28.4 24.3,27.6 24.3,25.74 U1.2
N$4  (via drill 0.6)
  Top 0.305: v24.1,49 v27.1,49
  Bottom 0.305: C2.1 22.85,61.2 26.6,61.2 27.3,60.51 U2.17 27.3,57.49 24.1,54.3 v24.1,49 | 32.5,49.4 32.1,49 v27.1,49
N$5  (via drill 0.6)
  Top 0.305: LED3.C 56.5,45.1 v55.5,46.1
  Bottom 0.305: OK1.1 54.71,50.89 55.5,50.1 v55.5,46.1
N$6
  Bottom 0.305: X1.2 17.9,24.2 19.3,25.6 21.62,25.6 U1.1
N$7  (via drill 0.6)
  Top 0.305: LED2.C 27.11,55.99 v28.1,55
  Bottom 0.305: U2.22 30.55,55.45 30.1,55 v28.1,55
N$8  (via drill 0.6)
  Top 0.305: LED1.C 32.84,57.26 v33.1,57
  Bottom 0.305: U2.23 31.2,57.1 31.8,56.5 32.6,56.5 v33.1,57
N$9
  Top 0.305: R1.1 29.27,57.32 LED1.A
N$10
  Top 0.305: R2.1 24.97,57.29 LED2.A
N$11
  Top 0.305: R5.1 59.52,47.22 LED3.A
N$12  (via drill 0.6)
  Top 0.305: U1.15 44.55,43.35 42.5,45.4 42.5,52 43.6,53.1 43.6,55.8 v38.8,60.6
  Bottom 0.305: v38.8,60.6 38.8,58.3 35.9,55.4 35.9,52.4 35.3,51.8 34.47,51.8 U2.1
N$13  (via drill 0.6)
  Top 0.305: U1.16 42.01,44.09 41.4,44.7 41.4,52.4 42.5,53.5 42.5,55.2 v36.1,60.6
  Bottom 0.305: U2.5 31.85,54.34 36.1,58.6 v36.1,60.6
N$14
  Bottom 0.305: X1.4 25.42,29.68 26.7,28.4 26.7,25.74 U1.3
N$15
  Top 0.305: X3.4 81.56,64 69.1,64 59.52,54.42 R5.2
N$16  (via drill 0.6)
  Top 0.305: LED4.C 44.56,45.54 v44.1,46
  Bottom 0.305: OK2.1 44.07,46.03 v44.1,46
N$17
  Top 0.305: LED4.A 46.54,49.94 R6.1
N$18  (via drill 0.6)
  Top 0.305: R6.2 46.52,55.28 v46.5,55.3
  Bottom 0.305: X3.2 76.28,67.18 73.1,64 49.2,64 46.5,61.3 v46.5,55.3
N$19  (via drill 0.6)
  Top 0.305: X3.3 81.2,68.72 81.2,67.3 78.9,65 67.1,65 57.5,55.4 v56.3,55.4
  Bottom 0.305: OK1.2 54.33,53.43 v56.3,55.4
N$20
  Bottom 0.305: X3.1 71.1,68.78 71.1,67 69.1,65 56.5,64.9 48.1,64.9 | 48.1,64.9 47.5,64.9 | OK2.2 44.07,62.97 46.1,65 48,65 48.1,64.9
N$21
  Top 0.305: R7.1 53.52,27.2 LED5.A
N$22  (via drill 0.6)
  Top 0.305: LED5.C 52.58,25.08 51.7,24.2 v51.7,23.2
  Bottom 0.305: v51.7,23.2 50.4,23.2 48.86,21.66 OK3.1
N$23
  Top 0.305: R8.1 56.12,27.11 LED6.A
N$24  (via drill 0.6)
  Top 0.305: LED6.C 57.71,24.99 v58.6,24.1
  Bottom 0.305: v58.6,24.1 57.4,24.1 55.46,22.16 OK4.1
N$25
  Bottom 0.305: Q1.1 64.16,23.36 62.7,21.9 62.7,21.05 R9.1
N$26
  Bottom 0.305: Q2.1 61.48,38.44 R10.1
N$27
  Bottom 0.305: K2.A2 69.82,43.07 68.13,43.07 67.1,44.1 66.1,44.1 | Q2.3 62.97,43.07 64,44.1 66.1,44.1 | D2.A 66.1,46.01 66.1,44.1
N$28
  Bottom 0.305: 62.1,29.1 62.67,29.1 66,29.1 67.1,28 67.1,26.1 67.9,25.3 70.03,25.3 K1.A2 | 62.1,29.1 D1.A | Q1.3 62.13,29.07 62.1,29.1
N$29
  Bottom 0.305: Q3.1 60.28,60.07 R11.1
N$30
  Bottom 0.305: Q3.3 60.97,62.23 62.3,60.9 64.78,60.9 D3.A K3.A2
N$31
  Bottom 1.27: K3.14 84.15,51.3 87.73,54.88 95.3,54.88 X14.1
N$32
  Bottom 1.27: K3.11 82.11,54.88 85.28,58.05 90.27,58.05 92.17,59.96 95.3,59.96 X14.2
N$33
  Bottom 1.27: K1.14 84.27,13.32 X4.1
N$34
  Bottom 1.27: K1.11 85.19,19.32 X4.2
N$35
  Bottom 1.27: K1.12 85.04,25.52 94.08,34.56 95.3,34.56 X4.3
N$36
  Bottom 1.27: K2.11 85.19,37.1 92.81,44.72 95.3,44.72 X7.2
N$37
  Bottom 1.27: K2.12 84.31,43.3 90.81,49.8 95.3,49.8 X7.3
N$38
  Bottom 1.27: K2.14 84.27,31.1 92.81,39.64 95.3,39.64 X7.1
N$39
  Bottom 1.27: K3.12 85.58,61.08 89.54,65.04 95.3,65.04 X14.3
N$40
  Top 0.305: 19.98,50.11 D4.A 20.09,50 16.1,50 13.35,52.75 X15.1
N$41  (via drill 3.2)
  other vias: 3.91,70.39
N$42
  Top 0.305: U1.22 26.77,42.67 28.1,44 28.1,45.63 SW1.P$1
N$43  (via drill 3.2)
  other vias: 3.91,3.81
N$44  (via drill 3.2)
  other vias: 96.62,70.39
N$45  (via drill 3.2)
  other vias: 96.62,3.81
N$46
  Top 0.305: R14.1 LED9.A
N$47
  Top 0.305: R13.1 LED8.A
N$48
  Top 0.305: R12.1 LED7.A
N$49
  Top 0.305: R15.2 LED10.C
N$50
  Top 0.305: R16.2 LED11.C
N$51
  Top 0.305: R17.2 LED12.C
N$52
  Top 0.305: R18.2 LED13.C
N$53
  Top 0.305: R19.2 LED14.C
N$54
  Top 0.305: R20.2 LED15.C
N$55  (via drill 2.8)
  other vias: 5.1,48
N$56
  Top 0.305: LED19.A R24.1
N$57
  Top 0.305: R25.1 LED20.A
N$58
  Top 0.305: LED17.A R22.1
N$59
  Top 0.305: LED18.A R23.1
N$60
  Top 0.305: LED16.A R21.1
N$61  (via drill 2.8)
  other vias: 5.1,60
N$62
  Top 0.305: R26.1 LED21.A
OPTO_IN1  (via drill 0.6)
  Top 0.305: R4.1 45.72,31.62 46.1,32 48.38,32 U1.30 | v63.7,45.4 63.7,43.9 64.4,43.2 64.4,39.7 v59.6,34.9
  Bottom 0.305: U1.30 51.85,30.75 53.5,32.4 57.1,32.4 v59.6,34.9 | v63.7,45.4 v63.7,49.7 | 63.65,49.75 v63.7,49.7 | OK1.4 63.31,50.89 63.7,50.5 v63.7,49.7
OPTO_IN2  (via drill 0.6)
  Top 0.305: R3.1 43,35 44.6,35 44.8,35.2 | U1.29 49.63,33.67 48.8,34.5 45.5,34.5 44.8,35.2 | 44.8,35.2 44.8,37.5 45.9,38.6 45.9,42.5 47.1,43.7 47.9,43.7 48.5,44.3 48.5,49.4 v48.4,49.5
  Bottom 0.305: 48.45,49.45 v48.4,49.5 48.4,56.4 50.7,58.7 OK2.4 | 53.7,58.7 OK2.4 | OK2.4
OPTO_OUT1
  Top 0.305: U1.28 52.17,35.83 53.5,34.5 53.5,32.04 R7.2
OPTO_OUT2
  Top 0.305: U1.27 47.09,36.29 47.9,37.1 52.8,37.1 56.1,33.8 56.1,32.03 R8.2
OUT1_C
  Bottom 0.305: X11.1 50.9,5.35 50.9,7.6 48.86,9.64 OK3.4
OUT1_E
  Bottom 0.305: X12.4 56,7.2 54.9,8.3 52.7,8.3 51.4,9.6 OK3.3
OUT2_C
  Bottom 0.305: X12.3 61.1,5.34 61.1,6.9 60.1,7.9 57.7,7.9 55.46,10.14 OK4.4
OUT2_E
  Bottom 0.305: X12.2 66.2,5.36 66.2,7.3 64.2,9.3 58.9,9.3 58,10.2 OK4.3
POS_CHECK
  Top 0.305: R17.1 U1.8
  Bottom 0.305: X11.4 35.68,8.18 39.5,12 39.5,25.64 U1.8
PWM_OUT
  Top 0.305: U1.12 49.63,20.53 49.1,20 49.36,20 R25.2
  Bottom 0.305: U1.12 50.96,27 58.1,27 60.1,25 60.1,17 61.1,16 61.1,12 62.1,11 66.1,11 67.1,10 76.73,10 X13.2
RELAY2
  Top 0.305: R12.2 28.04,22.06 27.1,23 20.7,23 19.5,24.2 19.5,27.2 20.7,28.4 33.1,28.4 34.5,29.8 46.14,29.8 U1.25
  Bottom 0.305: U1.25 48.84,29 58.1,29 61.1,26 61.1,19.5 61.5,19.1 62.71,19.1 R9.2
RELAY3
  Top 0.305: R13.2 19.83,20.27 18.1,22 18.1,28.7 19.8,30.4 32.5,30.4 35.5,33.4 46.98,33.4 U1.26
  Bottom 0.305: U1.26 47.09,33.39 48.3,34.6 57.7,34.6 59.6,36.5 59.6,38.34 R10.2
SCL
  Top 0.305: U1.13 49.63,57.53 56.1,64 56.1,68.73 X8.2
SDA
  Top 0.305: U1.14 47.09,39.01 48.1,38 50.1,38 52.1,40 52.1,56 61.1,65 61.1,68.81 X8.3
SLIDE_IN
  Top 0.305: U1.5 R20.1
  Bottom 0.305: 31.9,25.62 U1.5 31.5,25.32 31.5,19.7 20.44,8.64 X10.3
SLIDE_OUT
  Top 0.305: U1.6 R19.1
  Bottom 0.305: 34.5,25.56 U1.6 34.6,25.46 34.6,17.7 25.6,8.7 25.6,8.6 25.52,8.52 X10.2
SPINDLE_FULL
  Top 0.305: U1.9 R16.1
  Bottom 0.305: X11.3 40.76,9.06 42.1,10.4 42.1,25.58 U1.9
STEP_A  (via drill 0.6)
  Top 0.305: R21.2 U1.20 31.85,38.75 31.1,38 23.1,38 v21.1,36
  Bottom 0.305: v21.1,36 19.1,36 17.1,38 17.1,42 14.6,44.5 14.6,68.16 X5.2
STEP_B
  Top 0.305: U1.18 R23.2
  Bottom 0.305: U1.18 37.1,41.08 37.1,55 40.1,58 40.1,65 38.1,67 36.2,67 35.6,67.6 35.6,68.84 X6.2
VIN
  Top 0.305: REG1.1 53.67,13.43 53.1,14 53.1,18 52.1,19 52.1,21.2 52.7,21.8 54.55,21.8 C4.+
  Top 0.406: REG1.1 53.67,2.43 55.1,1 87.19,1 X9.1

### Text on the board
tNames: +5V | SA | DA | GND | +5V | SB | DB | GND | GND | SCL | SDA | +5V | C2 | A2 | C1 | A1 | C | pcm52.com | P | Drawbar | O | Modbus | C | P | Relay3 | O | CB220/320 | C | P | Relay2 | O | Download | + | +5V | Power | GND | VIn | +5V | Slide_I | Slide_O | Index | Pos | Spin | DB_Chk | O1_C | O1_E | O2_C | O2_E | GND | +5V | PWM | GND
bNames: +